# EAGLE design BT-RFID-Reader_v1.1 (EAGLE 6.4)
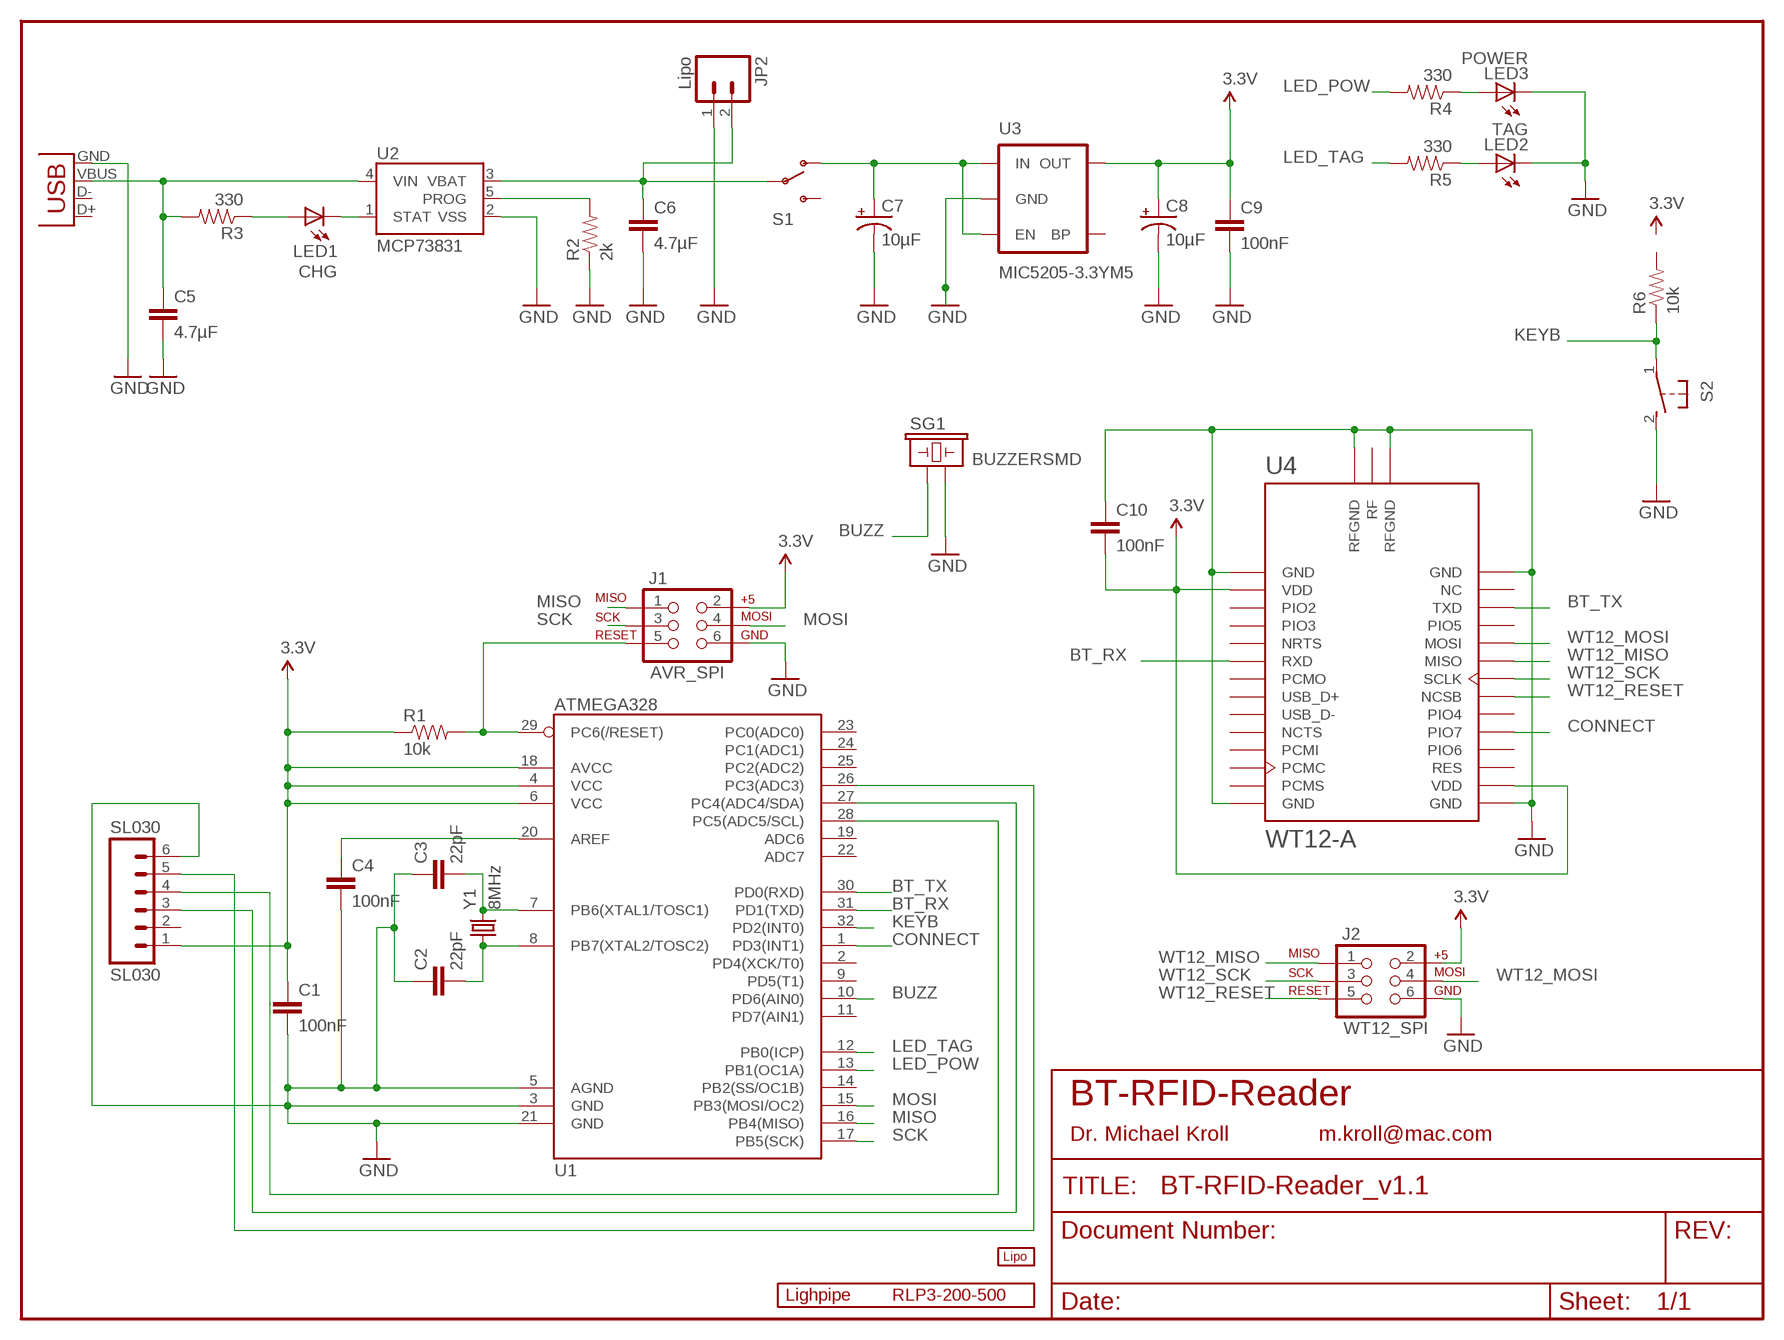
[diagram p0: schematic, sheet 1]

## Parts
C1  100nF  CAP1206  [1206]
C2  22pF  CAP1206  [1206]
C3  22pF  CAP1206  [1206]
C4  100nF  CAP1206  [1206]
C5  4.7µF  CAP1206  [1206]
C6  4.7µF  CAP1206  [1206]
C7  10µF  CAP_POL1206  [EIA3216]
C8  10µF  CAP_POL1206  [EIA3216]
C9  100nF  CAP1206  [1206]
C10  100nF  CAP1206  [1206]
J1  AVR_SPI  AVR_SPI_PRG_6PTH  [2X3]
J2  WT12_SPI  AVR_SPI_PRG_6PTH  [2X3]
JP2  Lipo  M02-JST-2MM-SMT  [JST-2-SMD]
LED1  CHG  LED1206  [LED-1206]
LED2  TAG  LED1206-YELLOW  [LED-1206-YELLOW]
LED3  POWER  LED1206-GREEN  [LED-1206-GREEN]
R1  10k  RESISTOR0805-RES  [0805]
R2  2k  RESISTOR0805-RES  [0805]
R3  330  RESISTOR0805-RES  [0805]
R4  330  RESISTOR0805-RES  [0805]
R5  330  RESISTOR0805-RES  [0805]
R6  10k  RESISTOR0805-RES  [0805]
S1  SWITCH-SPSTSMD2  [SWITCH-SPDT-SMD]
S2  31-XX  [B3F-31XX]
SG1  BUZZERSMD  [BUZZER-CMT1603]
SL030  SL030  [SL030]
U1  ATMEGA328  ATMEGA168  [TQFP32-08]
U2  MCP73831  [SOT23-5]
U3  MIC5205-3.3YM5  V_REG_LDOSMD  [SOT23-5]
U4  WT12-A  WT12-A-VISUAL  [WT12-A]
U$1  LIPO-OUTLINE1000  [LIPO-1000]
U$2  RLP3-200-500-OUTLINERLP3-200-500  [RLP3-200-500]
X1  USB-MICROB  [USB-MICROB]
Y1  8MHz  CRYSTALSMD  [HC49UP]

## Nets
3.3V: C1.1 C8.A(+) C9.1 C10.2 J1.2 J2.2 R1.1 SL030.1(VDD) U1.4(VCC) U1.6(VCC) U1.18(AVCC) U3.5(OUT) U4.VDD1(VDD) U4.VDD2(VDD)
BT_RX: U1.31(PD1(TXD)) U4.RXD
BT_TX: U1.30(PD0(RXD)) U4.TXD
BUZZ: SG1.P$1 U1.10(PD6(AIN0))
CONNECT: U1.1(PD3(INT1)) U4.PIO7
GND: C1.2 C2.1 C3.1 C4.2 C5.2 C6.2 C7.C(-) C8.C(-) C9.2 C10.1 J1.6 J2.6 JP2.1 LED2.C LED3.C R2.1 S2.2(S) SG1.P$2 SL030.6(GND) U1.3(GND) U1.5(AGND) U1.21(GND) U2.2(VSS) U3.2(GND) U4.GND1(GND) U4.GND2(GND) U4.GND3(GND) U4.GND4(GND) U4.RFGND1(RFGND) U4.RFGND2(RFGND) X1.GND
KEYB: R6.1 S2.1(P) U1.32(PD2(INT0))
LED_POW: R4.2 U1.13(PB1(OC1A))
LED_TAG: R5.2 U1.12(PB0(ICP))
MISO: J1.1 U1.16(PB4(MISO))
MOSI: J1.4 U1.15(PB3(MOSI/OC2))
N$1: C2.2 U1.8(PB7(XTAL2/TOSC2)) Y1.1
N$2: SL030.4(SLC) U1.28(PC5(ADC5/SCL))
N$3: SL030.3(SDA) U1.27(PC4(ADC4/SDA))
N$4: SL030.5(OUT) U1.26(PC3(ADC3))
N$5: C3.2 U1.7(PB6(XTAL1/TOSC1)) Y1.2
N$6: C5.1 R3.2 U2.4(VIN) X1.VBUS
N$7: C4.1 U1.20(AREF)
N$8: J1.5 R1.2 U1.29(PC6(/RESET))
N$9: R2.2 U2.5(PROG)
N$10: C6.1 JP2.2 S1.2(P) U2.3(VBAT)
N$11: C7.A(+) S1.1(O) U3.1(IN) U3.3(EN)
N$12: LED1.A R3.1
N$13: LED1.C U2.1(STAT)
N$15: LED3.A R4.1
N$16: LED2.A R5.1
SCK: J1.3 U1.17(PB5(SCK))
WT12_MISO: J2.1 U4.MISO
WT12_MOSI: J2.4 U4.MOSI
WT12_RESET: J2.5 U4.NCSB
WT12_SCK: J2.3 U4.SCLK
Unconnected: R6.2 S1.3(S) SL030.2(IN) U1.2(PD4(XCK/T0)) U1.9(PD5(T1)) U1.11(PD7(AIN1)) U1.14(PB2(SS/OC1B)) U1.19(ADC6) U1.22(ADC7) U1.23(PC0(ADC0)) U1.24(PC1(ADC1)) U1.25(PC2(ADC2)) U3.4(BP) U4.NC U4.NCTS U4.NRTS U4.PCMC U4.PCMI U4.PCMO U4.PCMS U4.PIO2 U4.PIO3 U4.PIO4 U4.PIO5 U4.PIO6 U4.RES U4.RF U4.USB_D+ U4.USB_D- X1.D+ X1.D-

## Notes on the sheet
- BT-RFID-Reader
- Dr. Michael Kroll | m.kroll@mac.com

## Library data of the parts
C1-C6 C9 C10 = SparkFun:CAP: Capacitor Standard 0603 ceramic capacitor, and 0.1" leaded capacitor.
C7 C8 = SparkFun:CAP_POL: Capacitor Polarized These are standard SMD and PTH capacitors. Normally 10uF, 47uF, and 100uF in electrolytic and tantalum varieties. Always verify the external diameter of the through hole cap, it varies with capacity, voltage, and manufacturer. The EIA devices should be standard.
J1 J2 = SparkFun:AVR_SPI_PRG_6: AVR ISP 6 Pin This is the reduced ISP connector for AVR programming. Common on Arduino. This footprint will take up less PCB space and can be used with a 10-pin to 6-pin adapter such as SKU: BOB-08508
JP2 = SparkFun:M02: Header 2 Standard 2-pin 0.1" header. Use with straight break away headers (SKU : PRT-00116), right angle break away headers (PRT-00553), swiss pins (PRT-00743), machine pins (PRT-00117), and female headers (PRT-00115). Molex polarized connector foot print use with SKU : PRT-08233 with associated crimp pins and housings.
LED1-LED3 = SparkFun:LED: LEDs Standard schematic elements and footprints for 5mm, 3mm, 1206, and 0603 sized LEDs. 5mm - Spark Fun Electronics SKU : COM-00529 (and others)
R1-R6 = SparkFun:RESISTOR: Resistor Basic schematic elements and footprints for 0603, 1206, and PTH resistors.
S1 = SparkFun:SWITCH-SPST: SPST Switch Simple slide switch. Spark Fun Electronics SKU : COM-00102
S2 = switch-omron:31-XX: OMRON SWITCH; MPN: B3F-3100; OC_FARNELL: 959704; OC_NEWARK: 36M3582
SG1 = SparkFun:BUZZER: Buzzer 12mm Spark Fun Electronics SKU : Comp-Buzzer
SL030 = Software-Culture-Parts:SL030: SL030 Being developed based on NXP's low power transponder ICs, HF RFID Module SL030 is a mini Mifare read/write module. It supports Mifare 1K, Mifare 4K and Ultralight and is applicable for 13.56MHz. It does auto Real-time detecting tag which moves into or out of detective range and reports thrugh one output pin's logic level. In addition, it integrates all necessary components and antenna in one PCB. In view of its maximum working current and sleep current are 45mA and 10uA respectively, SL030 is preferential for the applications which require low power cost. Model Mifare Module SL030 Frequency 13.56MHz Protocol ISO14443A Tag supported Ultralight, Mifare Mini, Mifare 1k,Mifare 4k, FM11RF08 Interface I2C Supply voltage 2.5 - 3.6VDC Dimension 38 × 38 mm
U1 = SparkFun:ATMEGA168
U2 = SparkFun:MCP73831: Microchip's MCP73831 Miniature single cell, fully integrated Li-Ion, Li-polymer charge management controller http://ww1.microchip.com/downloads/en/DeviceDoc/21984a.pdf
U3 = SparkFun:V_REG_LDO: Voltage Regulator LDO Standard 150mA LDO voltage regulator in SOT-23 layout. Micrel part MIC5205. BP (by-pass) pin is used to lower output noise with 470pF cap.
U4 = sf-bluegiga:WT12-A-VISUAL: Class 2 Bluetooth 2.1 + EDR module, chip antenna and RF pins
U$1 = SparkFun:LIPO-OUTLINE
U$2 = Software-Culture-Parts:RLP3-200-500-OUTLINE: RLP3-200-500 Lightpipe Mouser-Teilenr.: 749-RLP3-200-500 Hersteller-Teilenummer: RLP3-200-500 Hersteller: Bivar Beschreibung: LED-Lichtleiter SMD Triple RA 2.8mm 14mm Protrusion http://ch.mouser.com/ProductDetail/BIVAR/RLP3-200-500/?qs=DTo5u7NUXXFx9LvFoz1ccQ%3d%3d
X1 = SparkFun:USB: USB Connectors USB-B-PTH is fully proven SKU : PRT-00139 USB-miniB is fully proven SKU : PRT-00587 USB-A-PCB is untested. USB-A-H is throughly reviewed, but untested. Spark Fun Electronics SKU : PRT-00437 USB-B-SMT is throughly reviewed, but untested. Needs silkscreen touching up. USB-A-S has not been used/tested USB-MB-H has not been used/tested
Y1 = SparkFun:CRYSTAL: Crystals Various standard crystals. Proven footprints. Spark Fun Electronics SKU : COM-00534

## Board
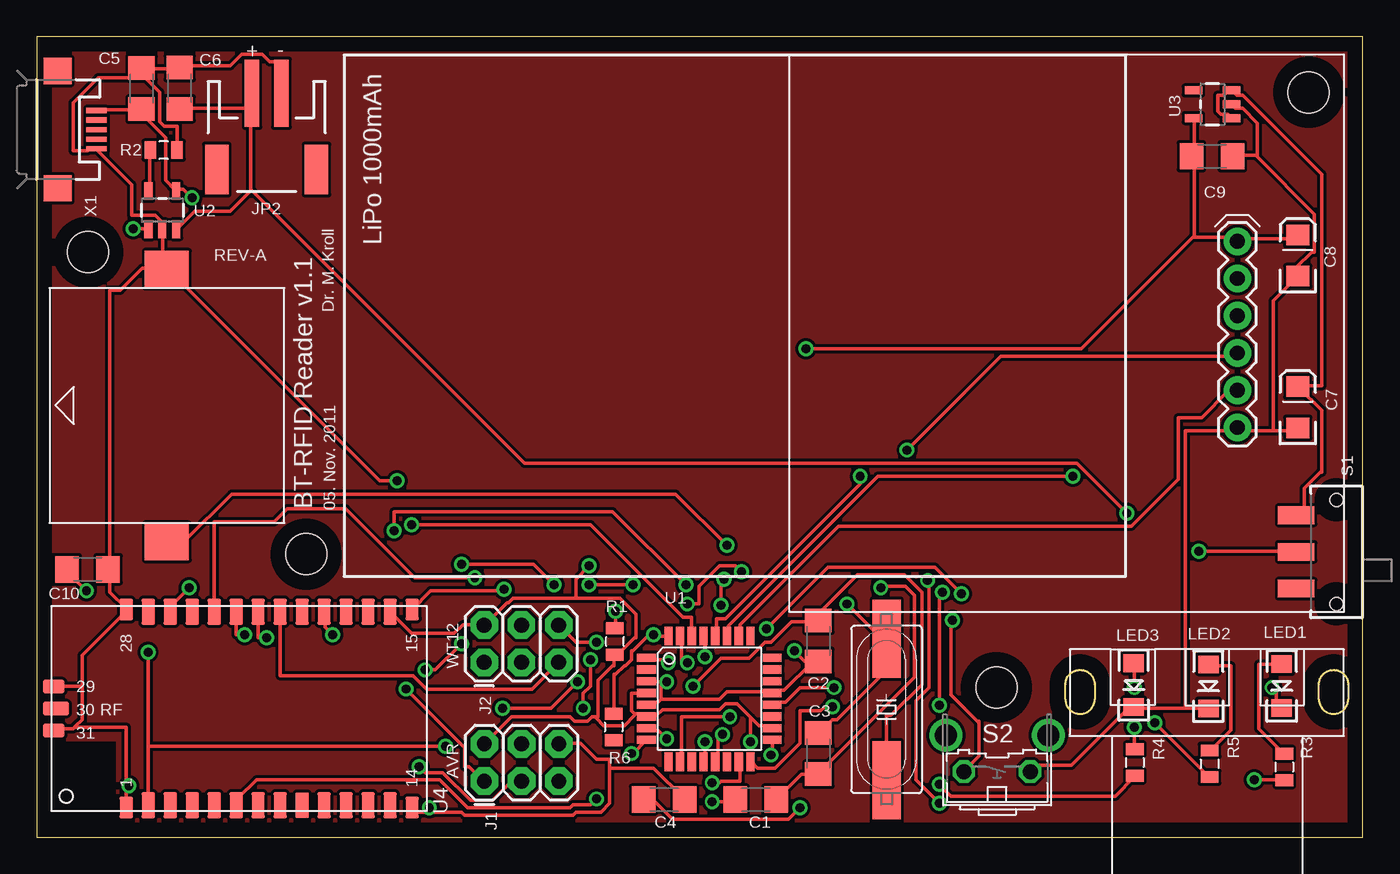
[diagram p1: board, top side]
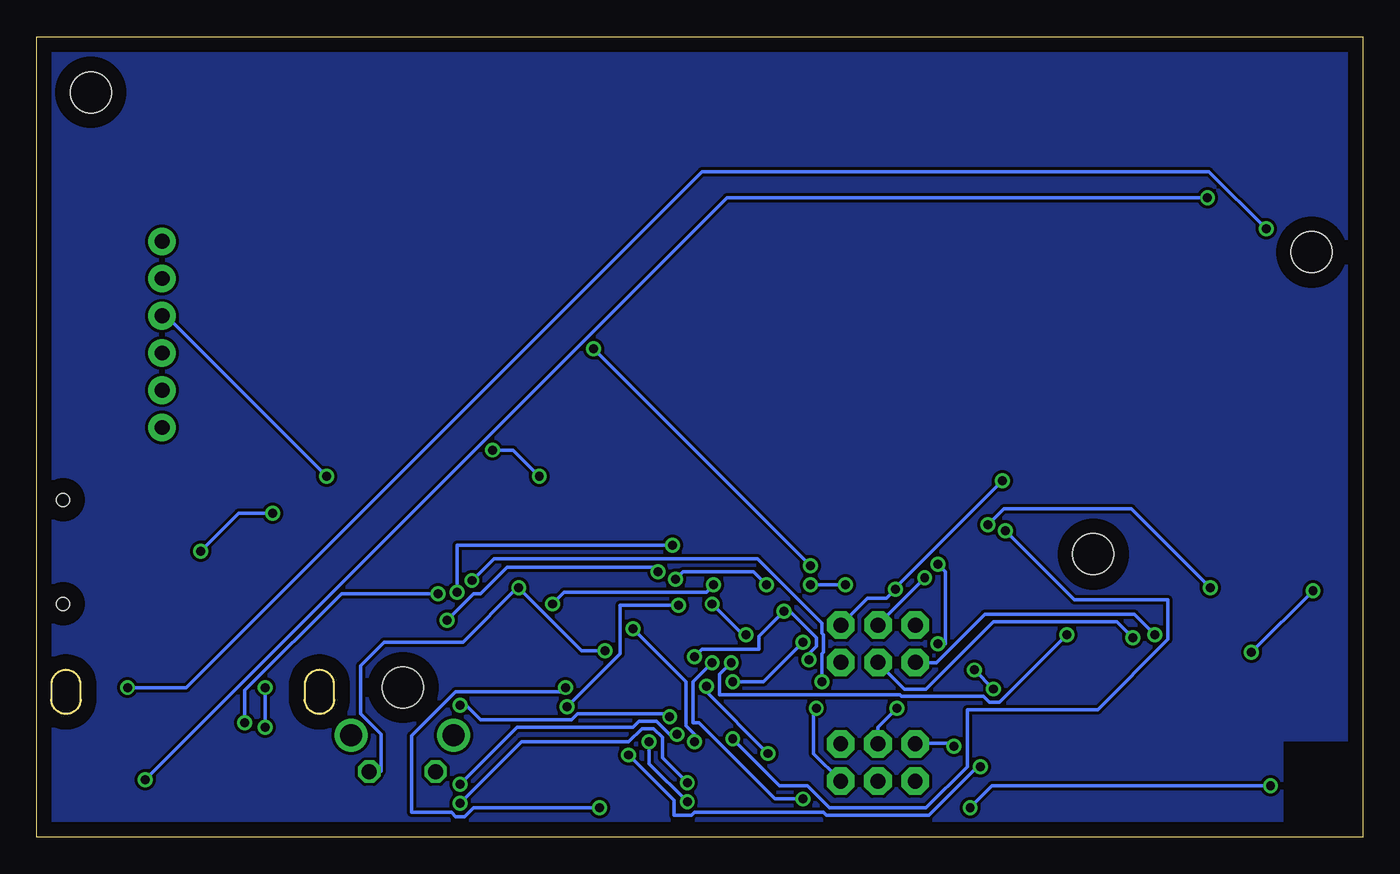
[diagram p2: board, bottom side, seen from below]

Size 90.5 x 54.6 mm. Coordinates in mm from the lower left corner, seen from the top.
Outline: 0,0 90.5,0 90.5,54.6 0,54.6 0,0
Copper layers (1*16): Top 0.035mm / dielectric 1.5mm / Bottom 0.035mm
Design rules "default": minimum track width 10mil, minimum drill 24mil, track to track 8mil, track to pad 8mil, pad to pad 8mil, via to via 8mil, smd to smd 8mil, copper to edge 40mil, drill to drill 8mil, minimum pad ring 10mil, minimum via ring 8mil, stop-mask expansion 4mil, vias tented up to drill 0mil, thermal gap 10mil
Holes 2.8 mm at 65.5,10.2 86.8,50.8 3.5,39.9 18.4,19.3
tRestrict: area 0,0 to 5.4,6.5
bRestrict: area 0,0 to 5.4,6.5

### Footprints (pad centres in the part's own frame; a part is rotated, then mirrored left to right if it is on the bottom)
1206 = smd 1.6 x 1.8: 1 -1.4,0; 2 1.4,0
EIA3216 = smd 1.4 x 1.6: A 1.4,0; C -1.4,0
2X3 = drill 1.016 pad 1.88 octagon: 1 0,0; 2 0,2.54; 3 2.54,0; 4 2.54,2.54; 5 5.08,0; 6 5.08,2.54
JST-2-SMD = smd 1 x 4.6: 1 -1,-3.7; 2 1,-3.7 | smd 1.6 x 3.4: NC1 -3.4,1.5; NC2 3.4,1.5
LED-1206 = smd 1.2 x 1.4: A -1.5,0; C 1.5,0
LED-1206-YELLOW = smd 1.2 x 1.4: A -1.5,0; C 1.5,0
LED-1206-GREEN = smd 1.2 x 1.4: A -1.5,0; C 1.5,0
0805 = smd 0.8 x 1.2: 1 -0.9,0; 2 0.9,0
SWITCH-SPDT-SMD = smd 1.2 x 2.5: 1 -2.5,-2.75; 2 0,-2.75; 3 2.5,-2.75 | hole 0.9: -3.55,0; 3.55,0
B3F-31XX = drill 1.016 octagon: 1 -2.261,-1.245; 2 2.261,-1.245 | drill 1.499 pad 2.159: 3 -3.505,1.245; 4 3.505,1.245
BUZZER-CMT1603 = smd 2.5 x 3: P$1 -9.3,0; P$2 9.3,0
SL030 = drill 1.016 pad 1.88: 1 0,0; 2 2.54,0; 3 5.08,0; 4 7.62,0; 5 10.16,0; 6 12.7,0
TQFP32-08 = smd 1.27 x 0.559: 1 -4.293,2.8; 2 -4.293,2; 3 -4.293,1.2; 4 -4.293,0.4; 5 -4.293,-0.4; 6 -4.293,-1.2; 7 -4.293,-2; 8 -4.293,-2.8; 17 4.293,-2.8; 18 4.293,-2; 19 4.293,-1.2; 20 4.293,-0.4; 21 4.293,0.4; 22 4.293,1.2; 23 4.293,2; 24 4.293,2.8 | smd 0.559 x 1.27: 9 -2.8,-4.293; 10 -2,-4.293; 11 -1.2,-4.293; 12 -0.4,-4.293; 13 0.4,-4.293; 14 1.2,-4.293; 15 2,-4.293; 16 2.8,-4.293; 25 2.8,4.293; 26 2,4.293; 27 1.2,4.293; 28 0.4,4.293; 29 -0.4,4.293; 30 -1.2,4.293; 31 -2,4.293; 32 -2.8,4.293
SOT23-5 = smd 0.55 x 1.2: 1 -0.95,-1.3; 2 0,-1.3; 3 0.95,-1.3; 4 0.95,1.3; 5 -0.95,1.3
WT12-A = smd 1.478 x 0.914: GND1 -6.75,7.7; GND2 -6.75,-11.8; GND3 6.75,-11.8; GND4 6.75,7.7 | smd 1.778 x 0.914: MISO 6.6,0.2; MOSI 6.6,1.7; NC 6.6,6.2; NCSB 6.6,-2.8; NCTS -6.6,-5.8; NRTS -6.6,1.7; PCMC -6.6,-8.8; PCMI -6.6,-7.3; PCMO -6.6,-1.3; PCMS -6.6,-10.3; PIO2 -6.6,4.7; PIO3 -6.6,3.2; PIO4 6.6,-4.3; PIO5 6.6,3.2; PIO6 6.6,-7.3; PIO7 6.6,-5.8; RES 6.6,-8.8; RXD -6.6,0.2; SCLK 6.6,-1.3; TXD 6.6,4.7; USB_D+ -6.6,-2.8; USB_D- -6.6,-4.3; VDD1 -6.6,6.2; VDD2 6.6,-10.3 | smd 0.914 x 1.778: RF 0,12.5 | smd 0.914 x 1.478: RFGND1 1.5,12.65; RFGND2 -1.5,12.65
USB-MICROB = smd 0.35 x 1.4: D+ 0,2.65; D- -0.65,2.65; GND 1.3,2.65; ID 0.65,2.65; VBUS -1.3,2.65 | smd 1.8 x 1.9: MT1 -4,0; MT2 4,0
HC49UP = smd 5.334 x 1.93: 1 -4.826,0; 2 4.826,0

### Placement (x,y rotation side)
C1  49.06,2.56 0 top
C2  53.34,13.38 90 top
C3  53.34,5.7 90 top
C4  42.82,2.56 0 top
C5  7.16,51.06 90 top
C6  9.76,51.08 90 top
C7  86.06,29.32 90 top
C8  86.06,39.67 90 top
C9  80.2,46.44 0 top
C10  3.48,18.26 180 top
J1  30.55,3.82 0 top
J2  30.54,11.92 0 top
JP2  15.7,47.04 180 top
LED1  84.96,10.3 270 top
LED2  79.96,10.28 270 top
LED3  74.86,10.36 270 top
R1  39.46,13.34 90 top
R2  8.67,46.86 180 top
R3  85.14,4.78 270 top
R4  74.94,5.09 270 top
R5  80.04,5 270 top
R6  39.37,7.51 270 top
S1  88.7,19.45 270 top
S2  65.54,5.71 0 top
SG1  8.89,29.44 90 top
SL030  81.94,40.64 270 top
U1  45.91,9.43 0 top
U2  8.58,42.76 0 top
U3  80.24,49.99 90 top
U4  13.82,8.77 90 top
U$1  20.98,53.34 270 top
U$2  79.9,10.9 0 top
X1  1.44,48.26 270 top
Y1  58,8.71 90 top

### Tracks (layer width: path | path; a pad name or v marks a point on that pad's centre or on a via)
3.3V  (via drill 0.61)
  Top 0.254: 7.6,6.2 v7.6,12.6 | 7.6,6.2 7.6,2.2 U4.VDD1 | v3.4,16.8 2,18.2 C10.2 | U3.5 79,49 79,46.5 78.8,46.5 C9.1 79,46.4 79,40.9 | C8.A 86,41 85.8,40.8 82.1,40.8 SL030.1 82.1,40.9 79,40.9 | 40.8,8.4 41.5,8.4 41.6,8.3 U1.6 41.7,8.3 42.3,8.3 42.7,8.7 46.6,8.7 47,9.1 47.8,9.1 48.75,8.15 | 40.8,8.4 40.6,8.6 40.6,9.8 41.6,9.8 U1.4 | 48.75,8.15 49.3,7.6 50.1,7.6 50.2,7.5 U1.18 | v46.1,2.4 47.5,2.4 C1.1 | v48.7,6.5 48.7,8.1 48.75,8.15 | U4.VDD2 24.2,15.3 25.6,13.9 28.5,13.9 29.1,14.5 30.5,14.5 J2.2 30.6,14.5 32.1,16 32.2,16 32.5,16.3 36.8,16.3 | 38.2,8.2 37.9,8.2 37.6,7.9 36.7,7.9 36.4,8.2 32.4,8.2 30.6,6.4 J1.2 | 38.2,8.2 38.3,8.2 38.3,10.7 39.3,11.7 39.4,11.7 39.4,12.4 R1.1 39.5,12.5 39.7,12.5 40.8,13.6 40.9,13.6 40.9,15.2 39.8,16.3 36.8,16.3 | 40.8,8.4 40.8,8.3 40.1,7.6 38.7,7.6 38.2,8.1 38.2,8.2 | v52.5,33.3 71.3,33.3 78.9,40.9 79,40.9 | v37.7,18.5 36.8,17.6 36.8,16.3 | 7.6,6.2 v27.9,6.2
  Bottom 0.254: v7.6,12.6 v3.4,16.8 | v46.1,2.4 48.7,5 v48.7,6.5 | v37.7,18.5 v52.5,33.3 | v27.9,6.2 28.1,6.4 30.5,6.4 J1.2
BT_RX  (via drill 0.61)
  Top 0.254: v44.4,11.9 44,11.9 44,13.7 U1.31 | v38.2,2.6 37.8,2.2 36.6,2.2 36.4,2 29.4,2 27.5,3.9 15,3.9 13.7,2.6 13.7,2.2 U4.RXD
  Bottom 0.254: v44.4,11.9 45.7,10.6 45.7,7.8 45.3,7.8 40.1,2.6 v38.2,2.6
BT_TX  (via drill 0.61)
  Top 0.254: v25.6,21.3 37.8,21.3 44.1,15 44.7,15 44.7,13.8 U1.30 | v10.4,17 9.2,15.8 9.2,15.4 U4.TXD
  Bottom 0.254: v25.6,21.3 24.5,22.4 15.8,22.4 v10.4,17
BUZZ  (via drill 0.61)
  Top 0.254: v47.3,8.2 44,8.2 44,5.2 U1.10 | v61.6,9 61.6,16.7 v61.8,16.7 | v47.1,19.9 43.6,23.4 13.3,23.4 10.1,20.2 8.9,20.2 SG1.P$1
  Bottom 0.254: v47.3,8.2 47.5,8.4 53.6,8.4 54,8 60.2,8 61.2,9 v61.6,9 | v61.8,16.7 61.8,19.9 v47.1,19.9
CONNECT  (via drill 0.61)
  Top 0.254: v43.1,11.9 42.9,12.1 41.8,12.1 41.7,12.2 U1.1 | v20.2,13.8 19.7,14.3 19.7,15.3 U4.PIO7
  Bottom 0.254: v43.1,11.9 43.9,11.1 43.9,9.7 31.6,9.7 31.5,9.6 25.9,9.6 25.5,9.2 24.8,9.2 v20.2,13.8
GND  (via drill 0.61)
  Top 0.254: 26.8,1.7 29,1.7 29.2,1.5 36.6,1.5 36.8,1.7 38.5,1.7 39.1,2.3 39.1,4.7 | 26.8,1.7 26,1.7 25.7,2 U4.GND2 | 39.1,4.7 39.1,5.3 38.2,5.3 37.1,6.4 35.7,6.4 J1.6 | C4.2 44.2,2.6 42.1,4.7 39.1,4.7 | 2.65,7.55 3.1,8 3.1,10.3 | 2.65,7.55 2.5,7.4 1.3,7.4 U4.RFGND2 | 3.1,10.3 1.2,10.3 U4.RFGND1 | 6.1,3.5 6.1,7.5 2.7,7.5 2.65,7.55 | 6.1,3.5 6.1,2.1 U4.GND1 | 3.1,10.3 3.1,12.4 6.1,15.4 U4.GND4 6.1,15.6 5,16.7 5,18.2 4.9,18.2 C10.1 5,18.3 5,37.3 5.7,37.3 7.2,38.8 8.5,38.8 SG1.P$2 | R2.1 9.6,46.9 9.6,48.5 8.7,48.5 8.4,48.8 8.4,50.8 7.2,52 7.2,52.4 C5.2 | C5.2 7.3,52.4 9.7,52.4 C6.2 9.8,52.6 13.2,52.6 14,53.4 15.4,53.4 15.9,52.9 16.7,52.9 JP2.1 | SG1.P$2 8.8,38.8 8.6,38.8 8.6,41.4 U2.2 8.5,41.5 8.5,42 8.1,42.4 6.5,42.4 6.5,44.5 4.1,46.9 X1.GND 4,47 3.7,47 3.5,46.8 2.5,46.8 2.5,50.1 4.2,51.8 6.9,51.8 7.1,52 C5.2 | v26.8,2 26.8,1.7 | 6.1,3.5 v6.3,3.5 | v31.9,16.9 31.8,16.8 26.9,16.8 U4.GND3 | C1.2 52.2,4.3 C3.1 53.4,4.4 59.9,10.9 59.9,16.5 59.3,17.1 57.7,17.1 v57.6,17 | 42.6,9.4 42.4,9.2 41.8,9.2 41.7,9.1 U1.5 | 42.6,10.5 42.6,10.6 41.7,10.6 U1.3 | 42.6,10.5 42.6,9.4 | 42.6,9.4 46.6,9.4 47.1,9.9 50.1,9.9 U1.21 50.3,9.9 50.4,10 51,10 52.9,11.9 53.3,11.9 C2.1 52.9,12 52.4,12 v51.7,12.7 | v38.2,13.3 36.8,13.3 35.7,14.4 J2.6 | v43,10.6 42.9,10.5 42.6,10.5 | 78.4,8.8 74.9,8.8 LED3.C 74.8,8.8 74.5,8.8 70.6,4.9 68.3,4.9 67.9,4.5 S2.2 | 78.4,8.8 79.9,8.8 LED2.C | 83.3,46.5 83.3,48.7 82.3,49.7 81.8,49.7 81.6,49.9 U3.2 | 83.3,46.5 81.6,46.5 C9.2 | 84.4,27.7 82.2,27.7 82,27.9 SL030.6 82.1,27.7 78.4,27.7 78.4,8.8 | 84.4,27.7 85.8,27.7 86,27.9 C7.C | 84.4,27.7 84.4,36.6 86,38.2 C8.C 86.1,38.4 86,38.4 86,38.9 87,39.9 87.2,39.9 87.2,42.5 83.3,46.4 83.3,46.5
  Top 0.254: v24.6,24.3 23.4,24.3 9,38.7 SG1.P$2
  Bottom 0.254: v26.8,2 25.3,3.5 v6.3,3.5 | J2.6 35.6,14.5 33.8,16.3 32.5,16.3 v31.9,16.9 31.9,17 v24.6,24.3 | v51.7,12.7 53.3,12.7 v57.6,17 57.7,17 61.4,13.3 66.8,13.3 68.4,11.7 68.4,8.4 67,7 67,4.5 67.8,4.5 S2.2 | v38.2,13.3 40.9,10.6 v43,10.6
KEYB  (via drill 0.61)
  Top 0.254: 42.1,13.7 43.1,13.7 U1.32 | 42.1,13.7 41.7,13.7 40.7,12.7 40.6,12.7 40.6,12.1 40.2,11.7 40.1,11.7 39.5,11.1 39.4,11.1 39.4,8.5 R6.1 | v62.5,14.8 62.4,14.8 62.4,9.7 64.2,7.9 64.3,7.9 64.3,5.5 63.3,4.5 S2.1 | v48.1,18.1 47.7,18.5 46.6,18.5 45.2,17.1 45.2,15.9 v44.4,15.9 | 42.1,13.7 v42.1,13.8
  Bottom 0.254: v62.5,14.8 60.7,16.6 60.2,16.6 58.4,18.4 48.4,18.4 v48.1,18.1 | v44.4,15.9 42.3,13.8 v42.1,13.8
LED_POW  (via drill 0.61)
  Top 0.254: v61.6,3.6 62.4,2.8 73.6,2.8 74.9,4.1 R4.2 | v46.8,7 46.5,6.7 46.5,5.2 46.4,5.2 U1.13
  Bottom 0.254: v61.6,3.6 57.7,7.5 49.8,7.5 49.4,7.9 48.2,7.9 47.3,7 v46.8,7
LED_TAG  (via drill 0.61)
  Top 0.254: v76.3,7.8 80,4.1 R5.2 | v63.1,16.6 61.3,18.4 54,18.4 v49.8,14.2 | v45.6,6.5 45.6,5.2 U1.12
  Bottom 0.254: v76.3,7.8 76.3,10 69.7,16.6 v63.1,16.6 | v49.8,14.2 46.2,10.6 46.2,7.6 45.6,7 v45.6,6.5
MISO  (via drill 0.61)
  Top 0.254: v54.3,8.9 53.8,8.9 53.5,8.6 52.1,8.6 52.1,6.4 50.4,4.7 49.2,4.7 48.8,5.1 U1.16 | v46.7,15.8 46.7,17.6 v46.9,17.6 | v37.7,17.2 v40.7,17.2 | v35.3,17.2 33.9,18.6 v29,18.6 | v29,13.2 27.2,11.4 v26.5,11.4 | v25.2,10.1 29.2,6.1 29.2,4.8 29.5,4.8 30.4,3.9 30.5,3.9 J1.1
  Bottom 0.254: v54.3,8.9 50.7,12.5 50.7,15.8 v46.7,15.8 | v46.9,17.6 46.4,18.1 41.6,18.1 v40.7,17.2 | v35.3,17.2 v37.7,17.2 | v29,18.6 28.5,18.1 28.5,13.2 v29,13.2 | v25.2,10.1 v26.5,11.4
MOSI  (via drill 0.61)
  Top 0.254: v46.1,3.7 46.6,3.7 46.7,3.8 48,3.8 48,5.1 U1.15 | v61.6,2.3 60,3.9 60,9.3 60.9,10.2 60.9,17.5 v60.8,17.5 | v36.9,10.6 35.1,8.8 v31.8,8.8
  Bottom 0.254: v46.1,3.7 47.8,5.4 47.8,6.8 48.4,7.4 49.2,7.4 50.1,6.5 57.4,6.5 v61.6,2.3 | v60.8,17.5 59.3,19 41.3,19 36.9,14.6 36.9,13.9 36.8,13.8 36.8,12.6 36.9,12.5 v36.9,10.6 | v31.8,8.8 33.1,7.5 33.1,6.4 J1.4
N$1  (via drill 0.61)
  Top 0.254: v40.6,5.7 40.7,5.7 41.6,6.6 U1.8 | v44.8,10.3 46.7,12.2 48.6,12.2 49.7,13.3 50.1,13.3 51.5,14.7 53.3,14.7 C2.2 52.9,14.8 56,17.9 59.2,17.9 60.4,16.7 60.4,10.4 58.3,8.3 58,8.3 Y1.1
  Bottom 0.254: v40.6,5.7 44.8,9.9 v44.8,10.3
N$2  (via drill 0.61)
  Top 0.254: v56.2,24.6 56.2,24.1 47,14.9 46.4,14.9 46.4,13.8 U1.28 | v59.4,26.4 65.8,32.8 81.7,32.8 81.9,33 SL030.4
  Bottom 0.254: v56.2,24.6 58,26.4 v59.4,26.4
N$3  (via drill 0.61)
  Top 0.254: v70.7,24.6 57.4,24.6 47.2,14.4 47.2,13.8 U1.27
  Bottom 0.254: v70.7,24.6 81.6,35.5 81.9,35.5 SL030.3
N$4
  Top 0.254: U1.26 48,13.8 48,14.5 54.7,21.2 74.7,21.2 77.9,24.4 77.9,28.6 79.5,28.6 81.3,30.4 81.9,30.4 SL030.5
N$5  (via drill 0.61)
  Top 0.254: v43,6.7 42.4,7.3 41.8,7.3 41.7,7.4 U1.7 | v24.4,20.9 24.4,22.2 39.3,22.2 v44.3,17.2 | v55.3,15.9 57.6,13.6 58,13.6 Y1.2 57.6,13.5 57.6,11 54.6,8 54.3,8 53.4,7.1 C3.2
  Bottom 0.254: v43,6.7 39.8,3.5 37.9,3.5 36.4,2 29.8,2 27,4.8 27,8.7 18.1,8.7 13.3,13.5 13.3,16.2 19.7,16.2 v24.4,20.9 | v44.3,17.2 44.8,16.7 54.5,16.7 v55.3,15.9
N$6  (via drill 0.61)
  Top 0.254: v83.1,3.9 85.1,3.9 R3.2 | v10.6,43.6 10,44.2 9.5,44.2 U2.4 9.5,44.1 8.8,44.8 8.8,47.7 7.2,49.3 7.2,49.6 C5.1 7.1,49.6 4.1,49.6 X1.VBUS
  Bottom 0.254: v83.1,3.9 43.4,43.6 v10.6,43.6
N$7  (via drill 0.61)
  Top 0.254: v54.4,10.2 52.1,10.2 51.1,9.2 50.4,9.2 50.3,9.1 U1.20 | v52.1,2 51.3,1.2 43.4,1.2 42.1,2.5 41.5,2.5 C4.1
  Bottom 0.254: v54.4,10.2 54.7,9.9 61.9,9.9 64.9,6.9 64.9,1.7 62.2,1.7 61.9,1.4 61.3,1.4 60.7,2 v52.1,2
N$8  (via drill 0.61)
  Top 0.254: v39.5,15.4 39.5,14.3 R1.2 | v45.6,12.3 45.6,13.7 U1.29 | v37.3,8.8 37.3,9.8 37.8,10.3 v37.8,12.1
  Bottom 0.254: v45.6,12.3 45.1,12.8 41.2,12.8 41.2,13.7 v39.5,15.4 39.1,15.4 37.3,13.6 37.3,13 37.8,12.5 v37.8,12.1 | v37.3,8.8 37.5,8.8 37.5,5.7 35.7,3.9 J1.5
N$9
  Top 0.254: U2.5 7.7,44.1 7.7,46.8 R2.2
N$10  (via drill 0.61)
  Top 0.254: 14.6,44.1 13.2,42.7 10.8,42.7 9.6,41.5 U2.3 | 14.6,44.1 14.6,50.7 14.7,50.7 JP2.2 14.5,49.7 9.8,49.7 C6.1 | v79.3,19.5 85.9,19.5 S1.2 | v74.4,22.1 71,25.5 33.3,25.5 14.7,44.1 14.6,44.1
  Bottom 0.254: v79.3,19.5 76.7,22.1 v74.4,22.1
N$11
  Top 0.254: U3.1 81.5,49.1 81.3,49.3 80.8,49.3 80.6,49.5 80.6,50.6 81,50.6 81.3,50.9 81.5,50.9 U3.3 81.6,50.9 81.9,50.6 82.3,50.6 87.7,45.2 87.7,30.8 86.1,30.8 C7.A 86.1,30.7 87.7,29.1 87.7,24.9 87.6,24.9 86.5,23.8 86.5,22 86,22 S1.1
N$12
  Top 0.254: R3.1 85.1,5.7 83.4,7.4 83.4,11.8 LED1.A
N$13  (via drill 0.61)
  Top 0.254: v6.6,41.5 7.6,41.5 U2.1 | v84.3,10.2 84.6,9.9 84.6,8.8 LED1.C
  Bottom 0.254: v6.6,41.5 10.5,45.4 45.1,45.4 80.3,10.2 v84.3,10.2
N$15  (via drill 0.61)
  Top 0.254: v74.9,7.5 74.9,6 R4.1 | v74.9,10.2 74.9,11.8 LED3.A
  Bottom 0.254: v74.9,7.5 v74.9,10.2
N$16
  Top 0.254: R5.1 80.1,5.9 81.5,7.3 81.5,11.7 80,11.7 LED2.A
S$1
  pour Bottom: 0,54.6 90.4,54.6 90.4,0 5.2,0 5.2,6.5 0,6.5
S$2
  pour Top: 90.5,54.6 0,54.6 0,6.4 5.2,6.4 5.2,0 90.5,0
SCK  (via drill 0.61)
  Top 0.254: v50.1,5.6 50.2,5.6 50.2,6.6 U1.17 | v26.1,4.8 26.5,4.4 27.7,4.4 29.6,2.5 31.1,2.5 32.4,3.8 33,3.8 J1.3
  Bottom 0.254: v50.1,5.6 47,2.5 47,1.5 45.8,1.5 45.6,1.7 36.8,1.7 36.6,1.5 29.6,1.5 26.3,4.8 v26.1,4.8
WT12_MISO  (via drill 0.61)
  Top 0.254: v14.2,13.8 13.6,13.8 13.6,15.3 U4.MISO
  Bottom 0.254: v14.2,13.8 15.6,15.2 25.8,15.2 29.1,11.9 30.5,11.9 J2.1
WT12_MOSI  (via drill 0.61)
  Top 0.254: v29.9,17.7 25.8,17.7 21.1,22.4 17.1,22.4 16.2,21.5 12.1,21.5 12.1,15.4 U4.MOSI
  Bottom 0.254: v29.9,17.7 33.1,14.5 J2.4
WT12_RESET
  Top 0.254: U4.NCSB 16.6,15.3 16.6,11 25.7,11 26.6,10.1 33.8,10.1 J2.5
WT12_SCK  (via drill 0.61)
  Top 0.254: v15.7,13.6 15.1,13.6 15.1,15.3 U4.SCLK
  Bottom 0.254: v15.7,13.6 16.8,14.7 25.2,14.7 29.8,10.1 31.3,10.1 33.1,11.9 J2.3

### Text on the board
tNames: - | + | REV-A | Dr. M. Kroll | BT-RFID Reader v1.1 | 05. Nov. 2011 | WT12 | AVR